# Altium schematic sheet Digital_Encoder_Breakout.SchDoc
size A4
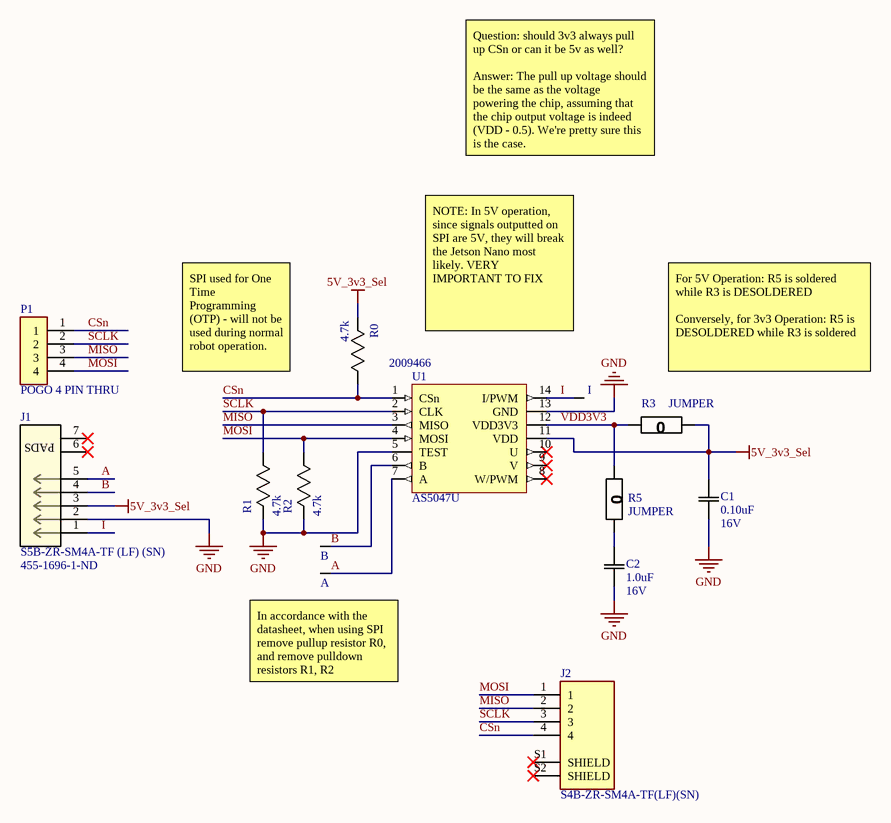
[diagram p0: Digital_Encoder_Breakout.SchDoc]

## Parts
A  Test Point (Via)  [TP]  (value not drawn)
B  Test Point (Via)  [TP]  (value not drawn)
C1  Rating: 16V  [0603]  (hidden comment: 0.10uF)
C2  Rating: 16V  [0603]  (hidden comment: 1.0uF)
I  Test Point (Via)  [TP]  (value not drawn)
J1  S5B-ZR-SM4A-TF (LF) (SN)  Supplier Part Number 1: 455-1696-1-ND  [JST_S5B-ZR-SM4A-TF]
J2  S4B-ZR-SM4A-TF(LF)(SN)  [JST_S4B-ZR-SM4A-TF(LF)(SN)]
P1  POGO 4 PIN THRU  [POGO 4 PIN THRU]
R0  4.7k  [0603]
R1  4.7k  [0603]
R2  4.7k  [0603]
R3  JUMPER  [0603]
R5  JUMPER  [0603]
U1  AS5047U  Supplier Part Number 1: 2009466  [AS5047U]

## Nets
5V_3v3_Sel: C1.2(C2) J1.3 R0.2(R2) R3.1(R1) U1.11(VDD)
GND: C1.1(C1) C2.2(C2) J1.2 R1.2(R2) R2.2(R2) U1.5(TEST) U1.13(GND)
A: A.1 J1.5 U1.7(A)
B: B.1 J1.4 U1.6(B)
CSn: J2.4 P1.1 R0.1(R1) U1.1(CSn)
I: I.1 J1.1 U1.14(I/PWM)
MISO: J2.2 P1.3 U1.3(MISO)
MOSI: J2.1 P1.4 R2.1(R1) U1.4(MOSI)
SCLK: J2.3 P1.2 R1.1(R1) U1.2(CLK)
VDD3V3: R3.2(R2) R5.1(R1) U1.12(VDD3V3)
NetC2_1: C2.1(C1) R5.2(R2)

Not connected (* = marked no-connect by the designer): J1 6* 7*; J2 S1(SHIELD)* S2(SHIELD)*; U1 8(W/PWM)* 9(V)* 10(U)*

## Notes on the sheet
- Question: should 3v3 always pull up CSn or can it be 5v as well?
  Answer: The pull up voltage should be the same as the voltage powering the chip, assuming that the chip output voltage is indeed (VDD - 0.5). We're pretty sure this is the case.
- NOTE: In 5V operation, since signals outputted on SPI are 5V, they will break the Jetson Nano most likely. VERY IMPORTANT TO FIX
- SPI used for One Time Programming (OTP) - will not be used during normal robot operation.
- For 5V Operation: R5 is soldered while R3 is DESOLDERED
  Conversely, for 3v3 Operation: R5 is DESOLDERED while R3 is soldered
- (near A) In accordance with the datasheet, when using SPI remove pullup resistor R0, and remove pulldown resistors R1, R2
- (in symbol CN 5POS JST ZR RA) PADS

## Library data of the parts
C1 = CAP 0.10uF 16V: CAP CER 0.10UF 16V X5R 0603/0805; Tolerance: 10%; Package: 0603/0805; Temperature Coefficient: X5R; Operating Temperature: -55°C ~ 85°C; Value: 0.10uF
C2 = CAP 1.0uF 16V: CAP CER 1.0UF 16V X5R 0603/0805; Tolerance: 10%; Package: 0603/0805; Temperature Coefficient: X5R; Operating Temperature: -55°C ~ 85°C; Value: 1.0uF
J1 = CN 5POS JST ZR RA: Connector Header Surface Mount, Right Angle 5 position 0.059" (1.50mm); Mfr_Name: JST; Copyright: Copyright (C) 2021 Ultra Librarian. All rights reserved.; Manufacturer_Part_Number: S5B-ZR-SM4A-TF (LF) (SN); Digi-Key_Part_Number_1: 455-1696-2-ND; Digi-Key_Part_Number_2: 455-1696-1-ND; Digi-Key_Part_Number_3: 455-1696-6-ND; RefDes: RefDes; Type: DEV; Supplier 1: Digi-Key
J2 = S4B-ZR-SM4A-TF(LF)(SN): Connector Header Surface Mount, Right Angle 4 position 0.059 (1.50mm); MF: JST Sales; SnapEDA_Link: https://www.snapeda.com/parts/S4B-ZR-SM4A-TF(LF)(SN)/JST%20Sales%20America%20Inc./view-part/449060/?ref=snap; Availability: Unavailable; Value: *; Price: None; Arrow_Electronics-Purchase-URL: https://snapeda.com/shop?store=Arrow+Electronics&id=449060; MP: S4B-ZR-SM4A-TF(LF)(SN); Package: None
P1 = POGO 4 PIN THRU: 4 pin POGO Holes 0.100" Pitch; ComponentLink1Description: POGO Pins; ComponentLink1URL: https://www.digikey.ca/en/products/detail/mill-max-manufacturing-corp/816-22-004-10-001101/6149707?utm_adgroup=Rectangular%20Connectors%20-%20Spring%20Loaded&utm_source=google&utm_medium=cpc&utm_campaign=Shopping_Product_Connectors%2C%20Interconnects&utm_term=&productid=6149707&gclid=CjwKCAjwyIKJBhBPEiwAu7zllx5RKB49Aiz1Tcq0lCLtxeAJbHB79ZaevgMe56kl4rzAjPwbrhvRoBoC1QsQAvD_BwE
R0-R2 = RES 4.7k 1/8W - 5%: RES SMD 4.7k OHM 5% 1/8W 0805; Power (Watts): 0.125W; Package: 0805; Value: 4.7k; Tolerance: 5%
R3 R5 = RES 0 JUMPER: RES SMD 0 OHM JUMPER GENERIC 0805/0603; Value: 0; Package: 0805
U1 = AS5047U: 14-Bit On-Axis Magnetic Rotary Position Sensor with Up to 14-Bit Binary Incremental Pulse Count; Supplier 1: RSComponents